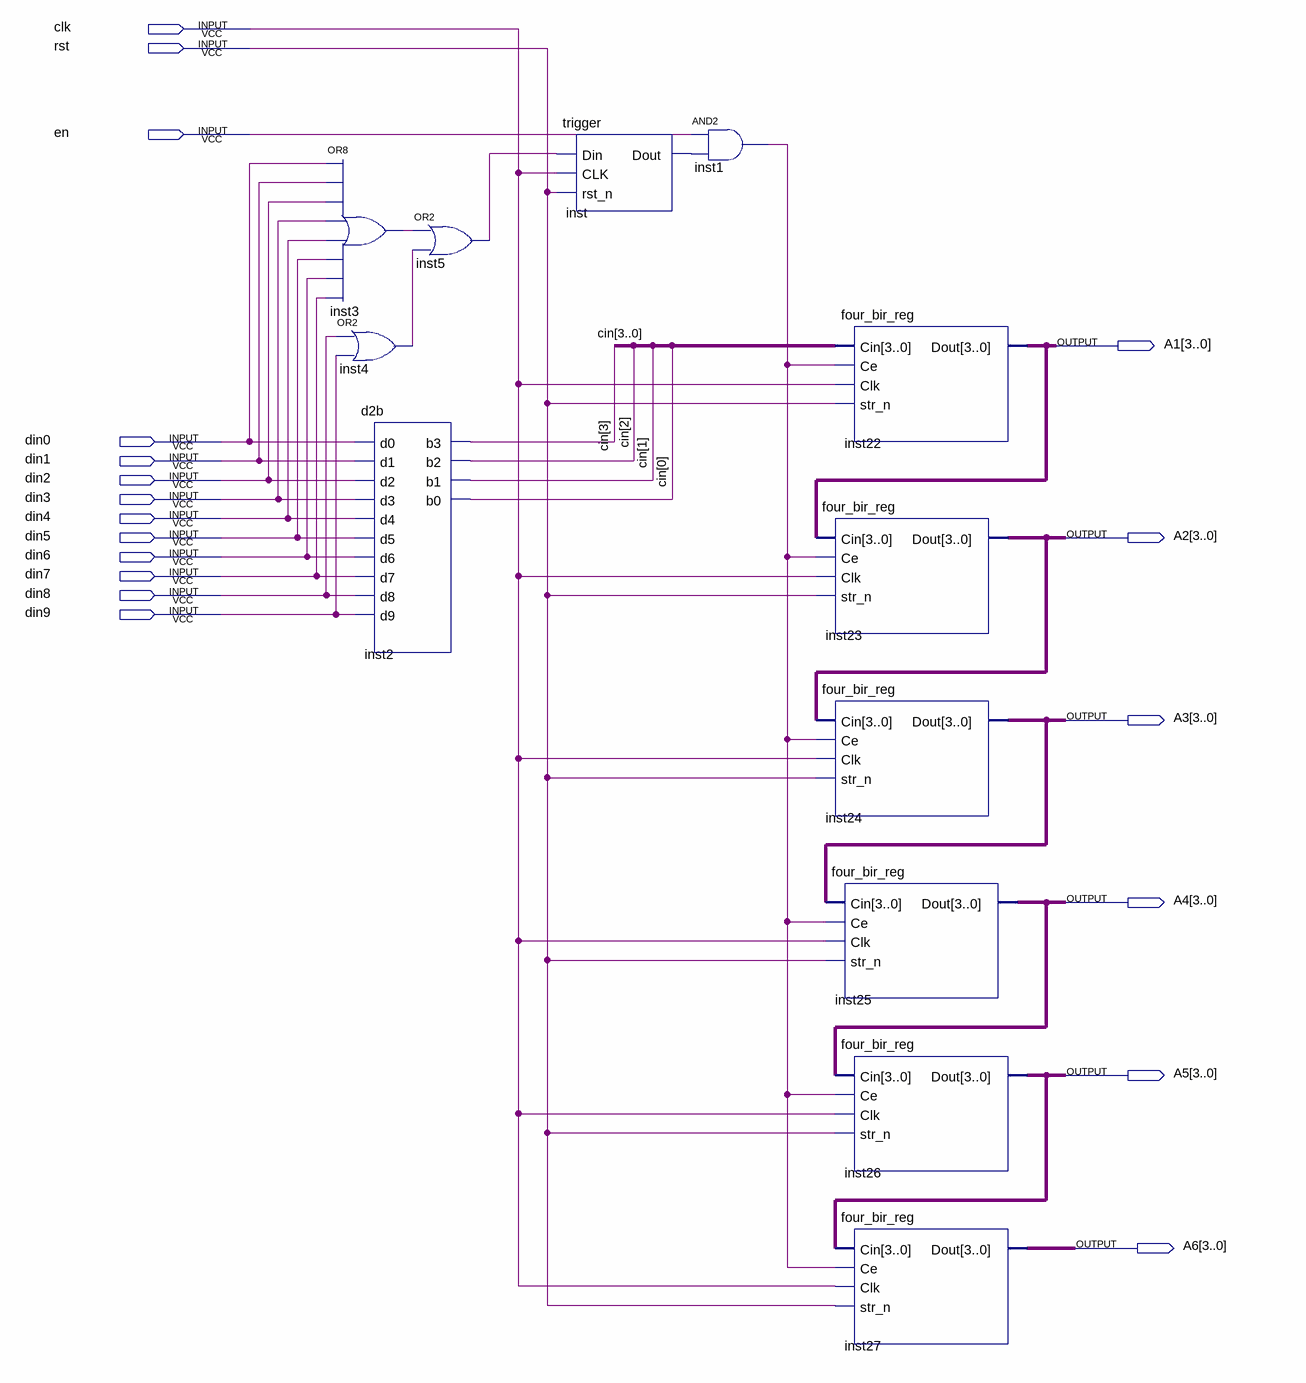
[diagram p0: schematic sheet]
// Quartus schematic stepTwo.bdf as structural Verilog: 12 symbols, 19 pins
module stepTwo (
  input  clk,
  input  rst,
  input  en,
  input  din0,
  input  din1,
  input  din2,
  input  din3,
  input  din4,
  input  din5,
  input  din6,
  input  din7,
  input  din8,
  input  din9,
  output [3:0] A1,
  output [3:0] A2,
  output [3:0] A3,
  output [3:0] A4,
  output [3:0] A5,
  output [3:0] A6
);

  wire inst1_out, inst3_out, inst4_out, inst5_out, inst_dout;
  wire [3:0] cin;

  or inst3 (inst3_out, din0, din1, din2, din3, din4, din5, din6, din7);
  or inst4 (inst4_out, din8, din9);
  d2b inst2 (
    .d0(din0), .d1(din1), .d2(din2), .d3(din3), .d4(din4), .d5(din5), .d6(din6), .d7(din7), .d8(din8),
    .d9(din9), .b3(cin[3]), .b2(cin[2]), .b1(cin[1]), .b0(cin[0]));
  or inst5 (inst5_out, inst3_out, inst4_out);
  trigger inst (.Din(inst5_out), .CLK(clk), .rst_n(rst), .Dout(inst_dout));
  and inst1 (inst1_out, en, inst_dout);
  four_bir_reg inst22 (.Cin(cin), .Ce(inst1_out), .Clk(clk), .str_n(rst), .Dout(A1));
  four_bir_reg inst23 (.Cin(A1), .Ce(inst1_out), .Clk(clk), .str_n(rst), .Dout(A2));
  four_bir_reg inst24 (.Cin(A2), .Ce(inst1_out), .Clk(clk), .str_n(rst), .Dout(A3));
  four_bir_reg inst25 (.Cin(A3), .Ce(inst1_out), .Clk(clk), .str_n(rst), .Dout(A4));
  four_bir_reg inst26 (.Cin(A4), .Ce(inst1_out), .Clk(clk), .str_n(rst), .Dout(A5));
  four_bir_reg inst27 (.Cin(A5), .Ce(inst1_out), .Clk(clk), .str_n(rst), .Dout(A6));
endmodule
